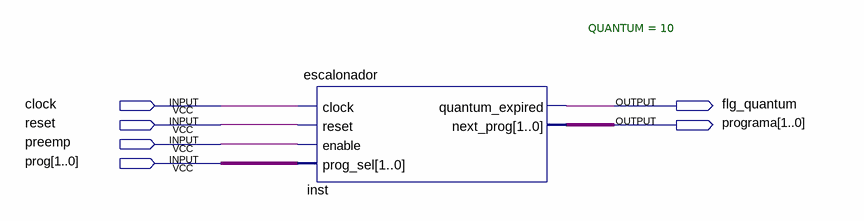
[diagram p0: schematic sheet]
// Quartus schematic Test.bdf as structural Verilog: 1 symbols, 6 pins
module Test (
  input  clock,
  input  reset,
  input  preemp,
  input  [1:0] prog,
  output flg_quantum,
  output [1:0] programa
);

  escalonador #(.QUANTUM(10)) inst (
    .clock(clock), .reset(reset), .enable(preemp), .prog_sel(prog), .quantum_expired(flg_quantum),
    .next_prog(programa));
endmodule
